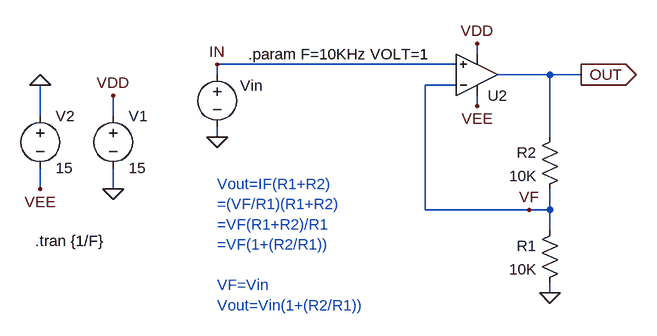
[diagram p0: schematic v1.0.asc]
v1.0.asc, the LTspice schematic file:
Version 4.1
SHEET 1 1240 700
WIRE 720 -1168 720 -1184
WIRE 688 -1152 320 -1152
WIRE 320 -1136 320 -1152
WIRE 832 -1136 752 -1136
WIRE 880 -1136 832 -1136
WIRE 688 -1120 640 -1120
WIRE 720 -1088 720 -1104
WIRE 48 -1072 48 -1120
WIRE 160 -1072 160 -1104
WIRE 320 -1040 320 -1056
WIRE 832 -1040 832 -1136
WIRE 48 -960 48 -992
WIRE 160 -960 160 -992
WIRE 640 -928 640 -1120
WIRE 800 -928 640 -928
WIRE 832 -928 832 -960
WIRE 832 -928 800 -928
WIRE 832 -896 832 -928
WIRE 832 -800 832 -816
FLAG 160 -1104 VDD
FLAG 160 -960 0
FLAG 320 -1040 0
FLAG 880 -1136 OUT
IOPIN 880 -1136 Out
FLAG 320 -1152 IN
FLAG 720 -1088 VEE
FLAG 48 -960 VEE
FLAG 720 -1184 VDD
FLAG 832 -800 0
FLAG 800 -928 VF
FLAG 48 -1120 0
SYMBOL voltage 160 -1088 R0
WINDOW 123 0 0 Left 2
WINDOW 39 0 0 Left 2
SYMATTR InstName V1
SYMATTR Value 15
SYMBOL voltage 320 -1152 M0
WINDOW 123 24 146 Left 2
WINDOW 39 24 125 Left 2
WINDOW 0 -70 33 Left 2
WINDOW 3 -272 57 Invisible 2
SYMATTR InstName Vin
SYMATTR Value SINE(0 {VOLT} {F})
SYMBOL res 848 -912 M0
SYMATTR InstName R1
SYMATTR Value 10K
SYMBOL res 848 -1056 M0
SYMATTR InstName R2
SYMATTR Value 10K
SYMBOL voltage 48 -1088 R0
WINDOW 123 24 146 Left 2
WINDOW 39 24 125 Left 2
SYMATTR InstName V2
SYMATTR Value 15
SYMBOL OpAmps\\UniversalOpAmp 720 -1136 M180
SYMATTR InstName U2
TEXT 40 -880 Left 2 !.tran {1/F}
TEXT 368 -1168 Left 2 !.param F=10KHz VOLT=1
TEXT 320 -968 Left 2 ;Vout=IF(R1+R2)\n=(VF/R1)(R1+R2)\n=VF(R1+R2)/R1\n=VF(1+(R2/R1))\n \nVF=Vin\nVout=Vin(1+(R2/R1))

The netlist it stands for:
* v1.0.asc
V1 VDD 0 15
Vin IN 0 SINE(0 {VOLT} {F})
R1 VF 0 10K
R2 OUT VF 10K
V2 0 VEE 15
X§U2 IN VF VEE VDD OUT level1 Avol=1Meg GBW=10Meg Vos=0 En=0 Enk=0 In=0 Ink=0 Rin=500Meg  ; pins In+ In- V+ V- OUT
.tran {1/F}
.param F=10KHz VOLT=1
* Vout=IF(R1+R2)
* =(VF/R1)(R1+R2)
* =VF(R1+R2)/R1
* =VF(1+(R2/R1))
* VF=Vin
* Vout=Vin(1+(R2/R1))
.lib UniversalOpAmp1.lib
.backanno
.end